# Altium schematic sheet IMU_LSM9DS1_SCH.SchDoc
size A4
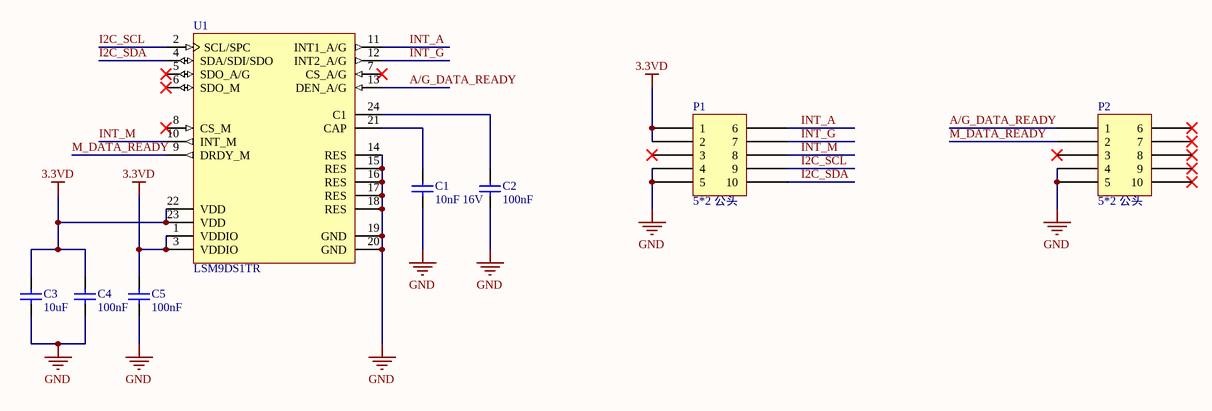
[diagram p0: IMU_LSM9DS1_SCH.SchDoc]

## Parts
C1  10nF 16V  [CAPC0603(1608)100_N]
C2  100nF  [CAPC0603(1608)100_N]
C3  10uF  [CAPC0603(1608)100_N]
C4  100nF  [CAPC0603(1608)100_N]
C5  100nF  [CAPC0603(1608)100_N]
P1  5*2 公头  [10pin 公头]
P2  5*2 公头  [10pin 公头]
U1  LSM9DS1TR  [STM-LGA-24_3500X3000X1000]

## Nets
3.3VD: C3.2 C4.2 C5.2 P1.1 P1.2 U1.1(VDDIO) U1.3(VDDIO) U1.22(VDD) U1.23(VDD)
GND: C1.1 C2.1 C3.1 C4.1 C5.1 P1.4 P1.5 P2.4 P2.5 U1.14(RES) U1.15(RES) U1.16(RES) U1.17(RES) U1.18(RES) U1.19(GND) U1.20(GND)
A/G_DATA_READY: P2.1 U1.13(DEN_A/G)
I2C_SCL: P1.9 U1.2(SCL/SPC)
I2C_SDA: P1.10 U1.4(SDA/SDI/SDO)
INT_A: P1.6 U1.11(INT1_A/G)
INT_G: P1.7 U1.12(INT2_A/G)
INT_M: P1.8 U1.10(INT_M)
M_DATA_READY: P2.2 U1.9(DRDY_M)
NetC1_2: C1.2 U1.21(CAP)
NetC2_2: C2.2 U1.24(C1)

Not connected (* = marked no-connect by the designer): P1 3*; P2 3* 6* 7* 8* 9* 10*; U1 5(SDO_A/G)* 6(SDO_M)* 7(CS_A/G)* 8(CS_M)*

## Library data of the parts
C1 C3 = CMP-1035-02588-1: CAP 10nF 16V ±10% 0603; Manufacturer: Vishay Vitramon; Manufacturer Part Number: VJ0603Y104KNXAO; Manufacturer: Yageo; Manufacturer Part Number: CC0603KPX7R8BB104; Manufacturer Part Number: VJ0603Y104KXXAP; Manufacturer: Murata; Manufacturer Part Number: GRM188R71E104KA01D; Manufacturer: TDK; Manufacturer Part Number: C1608X7R1E104K; Manufacturer: Kyocera AVX; Manufacturer Part Number: 06033C104KAT4A; Manufacturer Part Number: VJ0603Y104KXXCW1BC; Manufacturer Part Number: 06033C104KAT2A; Manufacturer Part Number: CC0603KRX7R8BB104; Manufacturer: KEMET; Manufacturer Part Number: C0603C104K3RACTU; Manufacturer Part Number: 06033C104KAT7A; Manufacturer Part Number: 06033D104KAT2A; Manufacturer Part Number: C0603C104K3RACTM; Manufacturer Part Number: 06033D104KAT4A; Manufacturer: Vishay; Manufacturer Part Number: VJ0603Y104KXXPW1BC; Manufacturer Part Number: C0603C104K3RAC; Manufacturer Part Number: VJ0603Y104KXXAC; Case-Metric: 1608; Rated Voltage: 25 V; Case-EIA: 0603; Value: 100nF; Tolerance: Â±10%; Max Thickness: 1 mm; Technology: SMT
C2 C4 C5 = CMP-1035-02588-1: CAP 10nF 16V ±10% 0603; Manufacturer: Vishay Vitramon; Manufacturer Part Number: VJ0603Y104KNXAO; Manufacturer: Yageo; Manufacturer Part Number: CC0603KPX7R8BB104; Manufacturer Part Number: VJ0603Y104KXXAP; Manufacturer: Murata; Manufacturer Part Number: GRM188R71E104KA01D; Manufacturer: TDK; Manufacturer Part Number: C1608X7R1E104K; Manufacturer: Kyocera AVX; Manufacturer Part Number: 06033C104KAT4A; Manufacturer Part Number: VJ0603Y104KXXCW1BC; Manufacturer Part Number: 06033C104KAT2A; Manufacturer Part Number: CC0603KRX7R8BB104; Manufacturer: KEMET; Manufacturer Part Number: C0603C104K3RACTU; Manufacturer Part Number: 06033C104KAT7A; Manufacturer Part Number: 06033D104KAT2A; Manufacturer Part Number: C0603C104K3RACTM; Manufacturer Part Number: 06033D104KAT4A; Manufacturer: Vishay; Manufacturer Part Number: VJ0603Y104KXXPW1BC; Manufacturer Part Number: C0603C104K3RAC; Manufacturer Part Number: VJ0603Y104KXXAC; Case-Metric: 1608; Rated Voltage: 25 V; Case-EIA: 0603; Tolerance: Â±10%; Max Thickness: 1 mm; Technology: SMT; Value: 100nF
U1 = CMP-2000-06606-1: iNEMO Inertial Module: 3D Accelerometer, 3D Gyroscope, 3D Magnetometer, 1.9 to 3.6 V, -40 to 85 degC, 24-Pin LGA, RoHS, Tape and Reel; Manufacturer: STMicroelectronics; SVHC: NoSVHC(17-Dec-2015); MEMS Module Function: Tri-AxisGyroscope,Tri-AxisAccelerometer,Tri-AxisMagnetometer; Supply Voltage Max: 3.6V; No. of Pins: 24Pins; Gyroscope Range: ±245°/s,±500°/s,±2000°/s; Acceleration Range: ±2g,±4g,±8g,±16g; Supply Voltage Min: 1.9V; Package Description: 24-Pin Plastic Land Grid Array Package, Body 3.65 x 3.15 mm, Pitch 0.43 mm; Manufacturer URL: http://www.st.com/; PartNumber: LSM9DS1; Product Range: -; Packaging: CutTape; Sensor Case Style: LGA; Datasheet URL: http://www2.st.com/content/ccc/resource/technical/document/datasheet/1e/3f/2a/d6/25/eb/48/46/DM00103319.pdf/files/DM00103319.pdf/jcr:content/translations/en.DM00103319.pdf; Package Reference: LGA-24_3500X3000X1000; Mounting Technology: SurfaceMount; Datasheet Version: Rev. 3, 03/2015; MSL: MSL3-168hours